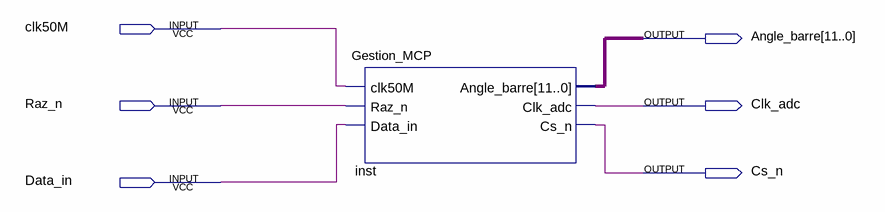
[diagram p0: schematic sheet]
// Quartus schematic gestion_verin.bdf as structural Verilog: 1 symbols, 6 pins
module gestion_verin (
  input  clk50M,
  input  Raz_n,
  input  Data_in,
  output [11:0] Angle_barre,
  output Clk_adc,
  output Cs_n
);

  Gestion_MCP inst (
    .clk50M(clk50M), .Raz_n(Raz_n), .Data_in(Data_in), .Angle_barre(Angle_barre), .Clk_adc(Clk_adc),
    .Cs_n(Cs_n));
endmodule
